# Altium schematic sheet 08-Power.SchDoc: Power
size A; Revision: A; SheetNumber: 8; SheetTotal: 10; ECE315_Project_Name: ECE315 F23 Wack-A-Mole
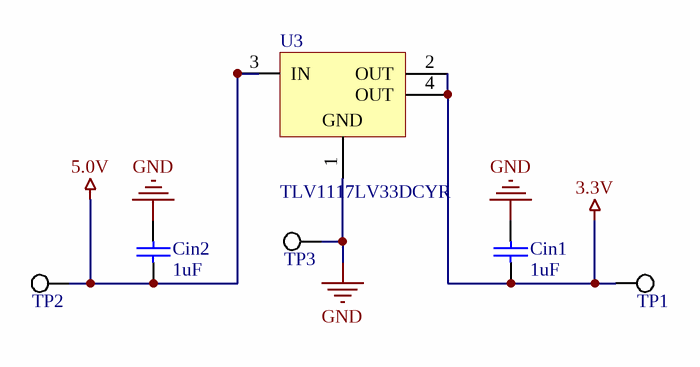
[diagram p0: 08-Power.SchDoc]

## Parts
Cin1  Capacitance: 1uF  [CAPC3216X180X50ML20T25]  (hidden comment: C1206C105K3RACTU)
Cin2  Capacitance: 1uF  [CAPC3216X180X50ML20T25]  (hidden comment: C1206C105K3RACTU)
TP1  5019  [KSTN-5019_V]  (value not drawn)
TP2  5019  [KSTN-5019_V]  (value not drawn)
TP3  5019  [KSTN-5019_V]  (value not drawn)
U3  TLV1117LV33DCYR  [DCY0004A_N]

## Nets
3.3V: Cin1.1 TP1.1 U3.2(OUT) U3.4(OUT)
5.0V: Cin2.1 TP2.1 U3.3(IN)
GND: Cin1.2 Cin2.2 TP3.1 U3.1(GND)

## Notes on the sheet
- Title:
- Size:
- A
- Project
- Rev:
- Sheet:
- of
- College of Engineering
- 1415 Engineering Drive
- Madison, WI 53706

## Library data of the parts
Cin1 Cin2 = CMP-2000-04991-1: Chip Capacitor, 1 uF, +/- 10%, 25 V, -55 to 125 degC, 1206 (3216 Metric), RoHS, Tape and Reel; Manufacturer: Kemet; Temperature Coefficient / Code: +/-15%; Dielectric: X7R; Voltage Rating DC: 25V; Capacitance - nF: 1000nF; Class: Class1; Case Length: 3.2mm; Case Width: 1.6mm; Product: GeneralTypeMLCCs; Datasheet URL: https://ciiva.com/datasheet-click-18194173?src=ciiva&sig=6daff8c4; Operating Temperature Range: -55Cto+125C; Series: C1206C; RoHS: Details; Product Category: MultilayerCeramicCapacitorsMLCC-SMD/SMT; Manufacturer URL: http://www.kemet.com/; Minimum Operating Temperature: -55C; Dimensions: 1.6mmWx3.2mmLx1.6mmH; Termination Style: SMD/SMT; Brand: Kemet; Type: SMDMLCCX7R6.3-250VDCCommericalGrade; Packaging: Reel; Package / Case: 1206(3216metric); Case Code - mm: 3216; Datasheet Version: Jul-14; Factory Pack Quantity: 2000; Package Description: 2-Pin Surface Mount Device, Body 3.2 x 1.6 mm; Tolerance: 10%; Package Reference: 1206; Case Height: 1.6mm; Case Code - in: 1206; Maximum Operating Temperature: +125C; Voltage Rating: 25V
TP1-TP3 = CMP-1672-00008-1: Test Point, 1 Position SMD, RoHS, Tape and Reel; ComponentLink1Description: Manufacturer URL; Package Quantity: 1000; DatasheetVersion: 03/2014; Packaging: Tape and Reel; ComponentLink2URL: http://www.keyelco.com/product-pdf.cfm?p=1357; ComponentLink1URL: http://www.keyelco.com/; Mount: Surface Mount; Contact Plating: Silver; PackageDescription: 1-Pin Surface Mount Device, Body 3.81 x 2.03 mm; Pins: 1; RoHSCompliant: True; Mounting Technology: Surface Mount; ComponentLink2Description: Datasheet; PackageReference: 5019
U3 = CMP-0395-00503-2: Single Output LDO, 1 A, Fixed 3.3 V Output, 2 to 5.5 V Input, 4-pin SOT-223 (DCY), -40 to 125 degC, Green (RoHS & no Sb/Br); Manufacturer: Texas Instruments; Vout Adj(Min)(V): 3.3; Vdo(Typ)(mV): 1200; Iq(Typ)(mA): 0.05; Accuracy(%): 2; Iout(Max)(A): 1; SubFamily: Single Channel LDO; Vin(Max)(V): 5.5; PackageReference: DCY0004A; PackageDescription: 4-Pin Plastic Small Outline, Body 3.5 x 6.5 mm, Pitch 2.3 mm; Vout Adj(Max)(V): 3.3; Mounting Technology: Surface Mount; ComponentLink2Description: Datasheet; ComponentLink1Description: Manufacturer URL; PartNumber: TLV1117LV33DCYR; ComponentLink3Description: Package Specification; ComponentLink1URL: http://www.ti.com/; ComponentLink2URL: http://www.ti.com/general/docs/lit/getliterature.tsp?genericPartNumber=TLV1117LV33&fileType=pdf; Fixed Output Options(V): 3.3; PackageVersion: 4202506/B; Vin(Min)(V): 2; DatasheetVersion: SBVS160A; Eco-Plan: Green (RoHS & no Sb/Br); ComponentLink3URL: http://www.ti.com/litv/pdf/mpds094a; Code_JEDEC: TO-261